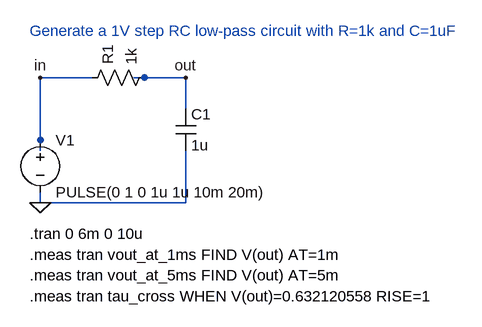
[diagram p0: schematic rc-lowpass-step.asc]
rc-lowpass-step.asc, the LTspice schematic file:
Version 4
SHEET 1 960 720
WIRE 176 112 96 112
WIRE 320 112 240 112
WIRE 320 160 320 112
WIRE 96 224 96 112
WIRE 320 256 320 224
WIRE 320 304 320 256
WIRE 96 304 96 288
WIRE 320 304 96 304
FLAG 96 304 0
FLAG 320 112 out
FLAG 96 112 in
SYMBOL voltage 96 192 R0
SYMATTR InstName V1
SYMATTR Value PULSE(0 1 0 1u 1u 10m 20m)
SYMBOL res 160 128 R270
SYMATTR InstName R1
SYMATTR Value 1k
SYMBOL cap 304 160 R0
SYMATTR InstName C1
SYMATTR Value 1u
TEXT 80 352 Left 2 !.tran 0 6m 0 10u
TEXT 80 384 Left 2 !.meas tran vout_at_1ms FIND V(out) AT=1m
TEXT 80 416 Left 2 !.meas tran vout_at_5ms FIND V(out) AT=5m
TEXT 80 448 Left 2 !.meas tran tau_cross WHEN V(out)=0.632120558 RISE=1
TEXT 80 40 Left 2 ;Generate a 1V step RC low-pass circuit with R=1k and C=1uF

The netlist it stands for:
* rc-lowpass-step.asc
V1 in 0 PULSE(0 1 0 1u 1u 10m 20m)
R1 in out 1k
C1 out 0 1u
.tran 0 6m 0 10u
.meas tran vout_at_1ms FIND V(out) AT=1m
.meas tran vout_at_5ms FIND V(out) AT=5m
.meas tran tau_cross WHEN V(out)=0.632120558 RISE=1
* Generate a 1V step RC low-pass circuit with R=1k and C=1uF
.backanno
.end